# EasyEDA Pro project Tiger Soldering Demo.eprj

# Schematic Schematic 1.1
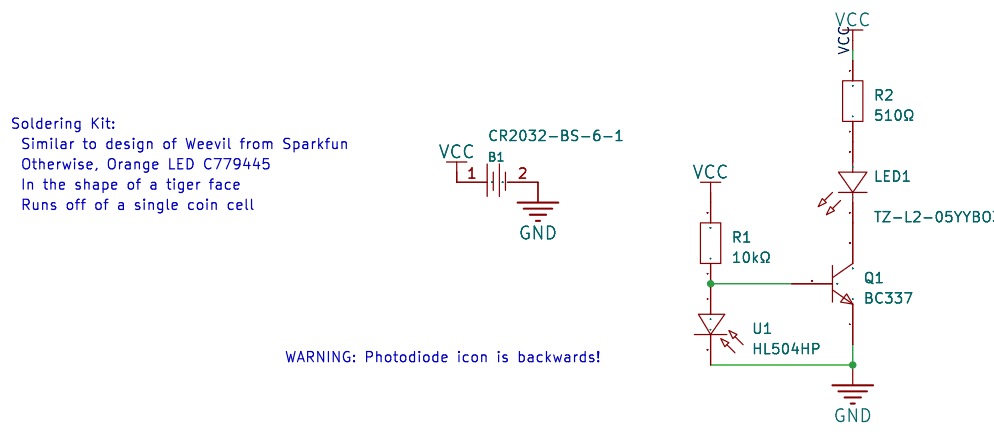
[diagram p0: schematic sheet]

## Parts
B1  CR2032-BS-6-1  [BAT-TH_CR2032-BS-6-1]
LED1  TZ-L2-05YYBO3TDJ15-001  [LED-TH_BD5.8-P2.54-L-RD]
Q1  BC337  [TO-92-3_L4.8-W3.7-P2.54-R]
R1  10kΩ  [RES-TH_BD2.7-L6.2-P10.20-D0.4]
R2  510Ω  [RES-TH_BD2.7-L6.2-P10.20-D0.4]
U1  HL504HP  [LED-TH_BD5.8-P2.54-FD]

## Library data of the parts
B1 = CR2032-BS-6-1: Connector Type:Battery base Battery Type:CR2032 Operating Temperature Range:- Operating Temperature Range:-; LCSC Part Name: 电池底座 适用电池:CR2032; Supplier Part: C70377; Manufacturer: Q&J; Supplier Footprint: SMD; JLCPCB Part Class: Extended Part; Datasheet: https://atta.szlcsc.com/upload/public/pdf/source/20160427/1461725216549.pdf; Supplier: LCSC; Connector Type: Battery base; Battery Type: CR2032
LED1 = TZ-L2-05YYBO3TDJ15-001: Emitted Color:Orange Diode Configuration:- Lens Color:Colorless transparence Dominant Wavelength:600nm~605nm Dominant Wavelength:600nm~605nm Peak Wavelength:- Color Temperature:- Color Temperature:- Forward Current:20mA Power Dissipation:60mW Viewing Angl; LCSC Part Name: 橙灯; Supplier Part: C779445; Manufacturer: TUOZHAN(拓展光电); Supplier Footprint: 插件,D=5mm; JLCPCB Part Class: Extended Part; Datasheet: https://atta.szlcsc.com/upload/public/pdf/source/20200925/C779445_C861B472C10CC762C334E0254EB2FD63.pdf; Supplier: LCSC; Emitted Color: Orange; Lens Color: Colorless transparence; Dominant Wavelength: 600nm~605nm; Forward Current: 20mA; Power Dissipation: 60mW; Viewing Angle: 15°; Operating Temperature: -40℃~+80℃; Lamp Holder Type: 5mm圆形灯头
Q1 = BC337: Transistor Type: Collector-Emitter Breakdown Voltage (Vceo): Collector Current (Ic): Power Dissipation (Pd): Collector Cut-Off Current (Icbo):100nA Collector-Emitter Saturation Voltage (VCE(sat)@Ic,Ib):700mV@500mA,50mA DC Current Gain (hFE@Ic,Vce):100@100; LCSC Part Name: NPN 45V 800mA; Supplier Part: C328602; Manufacturer: BLUE ROCKET(蓝箭); Supplier Footprint: TO-92-3; JLCPCB Part Class: Extended Part; Datasheet: https://atta.szlcsc.com/upload/public/pdf/source/20181114/C328602_2BE2B884E7C282175BCFE1345E8CDD23.pdf; Supplier: LCSC; Collector Cut-Off Current (Icbo): 100nA; Collector-Emitter Saturation Voltage (VCE(sat)@Ic,Ib): 700mV@500mA,50mA; DC Current Gain (hFE@Ic,Vce): 100@100mA,1V; Transition Frequency (fT): 100MHz; Operating Temperature: +150℃@(Tj)
R1 = CR1/4W-10K±5%-ST26: Type:Carbon Resister Resistance: Tolerance:±5% Tolerance:±5% Power(Watts):250mW Temperature Coefficient:±350ppm/℃ Temperature Coefficient:±350ppm/℃ Overload Voltage (Max):250V Operating Temperature Range:-55℃~+155℃ Operating Temperature Range:-55℃~+155℃; LCSC Part Name: 碳膜电阻 10kΩ ±5% 250mW; Supplier Part: C2894599; Manufacturer: VO(翔胜); Supplier Footprint: 插件,2.7x6.2mm; JLCPCB Part Class: Extended Part; Datasheet: https://atta.szlcsc.com/upload/public/pdf/source/20210803/C2857407_45FF53FE186CAB545115AD37303966CD.pdf; Supplier: LCSC; Type: Carbon Resister; Tolerance: ±5%; Power(Watts): 250mW; Temperature Coefficient: ±350ppm/℃; Overload Voltage (Max): 250V; Operating Temperature Range: -55℃~+155℃
R2 = CR1/4W-510Ω±5%-ST26: Type:Carbon Resister Resistance: Tolerance:±5% Tolerance:±5% Power(Watts):250mW Temperature Coefficient:±350ppm/℃ Temperature Coefficient:±350ppm/℃ Overload Voltage (Max):250V Operating Temperature Range:-55℃~+155℃ Operating Temperature Range:-55℃~+155℃; LCSC Part Name: 碳膜电阻 510Ω ±5% 250mW; Supplier Part: C2896843; Manufacturer: VO(翔胜); Supplier Footprint: 轴向引线,2.7x6.2mm; JLCPCB Part Class: Extended Part; Datasheet: https://atta.szlcsc.com/upload/public/pdf/source/20210803/C2857407_45FF53FE186CAB545115AD37303966CD.pdf; Supplier: LCSC; Type: Carbon Resister; Tolerance: ±5%; Power(Watts): 250mW; Temperature Coefficient: ±350ppm/℃; Overload Voltage (Max): 250V; Operating Temperature Range: -55℃~+155℃
U1 = HL504HP: Supplier Part: C242253; Manufacturer: JCHL(晶创和立); Supplier Footprint: 插件,D=5mm; JLCPCB Part Class: Extended Part; Datasheet: https://atta.szlcsc.com/upload/public/pdf/source/20200707/C242253_7EEF6AD93F859C8B56857151B9D59459.pdf; Supplier: LCSC

## Nets
GND: B1.2 Q1.1(E) U1.2(K)
VCC: B1.1 R1.2 R2.2
$1N548: Q1.2(B) R1.1 U1.1(A)
$1N640: LED1.2(+) R2.1
$1N987: LED1.1(-) Q1.3(C)

## Notes on the sheet
- Soldering Kit:
- Otherwise, Orange LED C779445
- Similar to design of Weevil from Sparkfun
- In the shape of a tiger face
- Runs off of a single coin cell
- WARNING: Photodiode icon is backwards!

# Schematic Schematic 1.2
Board Name: V1.2; Create Date: 2025-07-20; Page Name: Tiger Badge; Project Name: Tiger Soldering Demo; Schematic Name: Schematic 1.2; Update Date: 2026-01-14
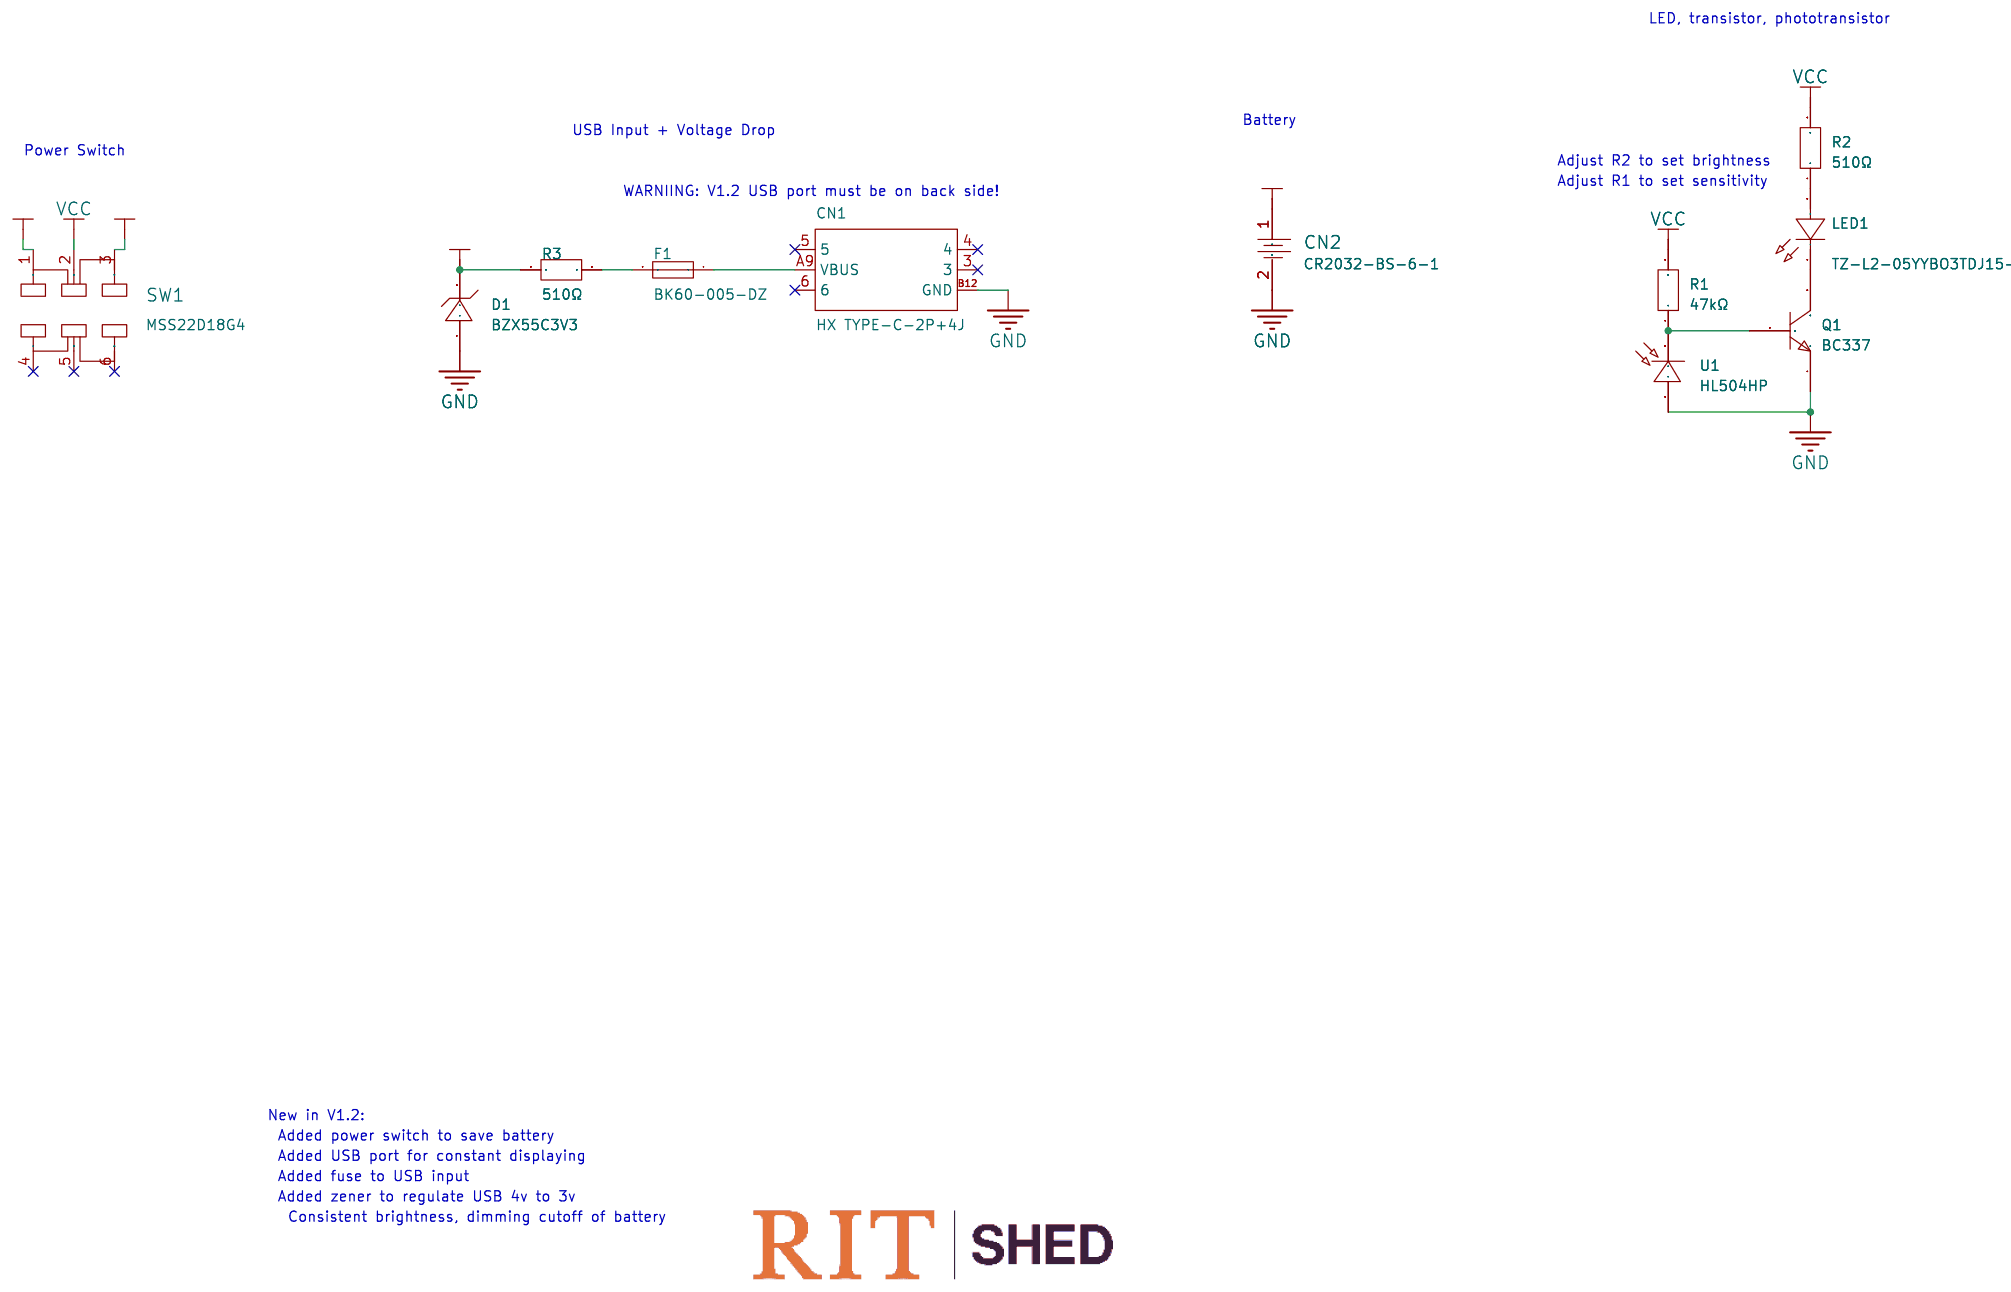
[diagram p1: schematic sheet]

## Parts
CN1  HX TYPE-C-2P+4J  [USB-C-TH_TYPE-C-TYPE-C-2P-4J]
CN2  CR2032-BS-6-1  [BAT-TH_CR2032-BS-6-1]
D1  BZX55C3V3  [DO-35_BD2.0-L4.0-P8.00-D0.5-FD]
F1  BK60-005-DZ  [FUSE-TH_L6.0-W3.0-P5.08-D1.0-S1.0]
LED1  TZ-L2-05YYBO3TDJ15-001  [LED-TH_BD5.8-P2.54-L-RD]
Q1  BC337  [TO-92-3_L4.8-W3.7-P2.54-R]
R1  47kΩ  [RES-TH_BD2.7-L6.2-P10.20-D0.4]
R2  510Ω  [RES-TH_BD2.7-L6.2-P10.20-D0.4]
R3  510Ω  [RES-TH_BD2.7-L6.2-P10.20-D0.4]
SW1  MSS22D18G4  [SW-TH_MSS22D18GX]
U1  HL504HP  [LED-TH_BD5.8-P2.54-FD]

## Library data of the parts
CN1 = HX TYPE-C-2P+4J: Connector Type:Type-C Protocol Standard:- Gender:Female Mounting Type:Bend-in Number of Contacts:2P Number of Ports:1 Current Rating-Power:3A Voltage Rating:20V Connect-Disconnect Life:5000 Cuts Center Height:1.68mm Length:6.5mm Detection color:Black Oper; LCSC Part Name: Type-C 母 弯插; Supplier Part: C25168796; Manufacturer: hanxia(韩下); Supplier Footprint: 插件; JLCPCB Part Class: Extended Part; Datasheet: https://atta.szlcsc.com/upload/public/pdf/source/20250106/37D5C40B555D99FBC6ED90BAD13C794C.pdf; Supplier: LCSC; Connector Type: Type-C; Gender: Female; Mounting Type: Bend-in; Number of Contacts: 2P; Number of Ports: 1; Current Rating-Power: 3A; Voltage Rating: 20V; Connect-Disconnect Life: 5000 Cuts; Center Height: 1.68mm; Length: 6.5mm; Detection color: Black; Operating Temperature: -30℃~+80℃
CN2 = CR2032-BS-6-1: Connector Type:Battery base Battery Type:CR2032 Operating Temperature Range:- Operating Temperature Range:-; LCSC Part Name: 电池底座 适用电池:CR2032; Supplier Part: C70377; Manufacturer: Q&J; Supplier Footprint: SMD; JLCPCB Part Class: Extended Part; Datasheet: https://atta.szlcsc.com/upload/public/pdf/source/20160427/1461725216549.pdf; Supplier: LCSC; Connector Type: Battery base; Battery Type: CR2032
D1 = BZX55C3V3: Supplier Part: C2507; Manufacturer: ST(先科); Supplier Footprint: DO-35; JLCPCB Part Class: Extended Part; Datasheet: https://atta.szlcsc.com/upload/public/pdf/source/20170719/C118630_1500457760295828336.pdf; Supplier: LCSC; Diode Configuration: Independent Type; Zener Voltage(Nom): 3.3V; Reverse Leakage Current (Ir): 2uA@1V; Zener Voltage(Range): 3.1V~3.5V; Impedance(Zzt): 85Ω
F1 = BK60-005-DZ: LCSC Part Name: 60V 50mA 插件自恢复; Supplier Part: C268796; Manufacturer: Brightking(君耀电子); Supplier Footprint: 插件; Datasheet: https://atta.szlcsc.com/upload/public/pdf/source/20181228/C268805_884F985A40511EB6935C25FE5D5FD463.pdf; Supplier: LCSC; Voltage - Max: 60V; Current - Max: 40A; Hold Current: 50mA; Trip Current: 100mA; Power Dissipation: 300mW; Resistance - Initial (Ri) (Min): 7.5Ω; Resistance - Post Trip (R1) (Max): 25Ω; Time to Trip(Max): 5s; Operating Temperature: -40℃~+85℃
LED1 = TZ-L2-05YYBO3TDJ15-001: Emitted Color:Orange Diode Configuration:- Lens Color:Colorless transparence Dominant Wavelength:600nm~605nm Dominant Wavelength:600nm~605nm Peak Wavelength:- Color Temperature:- Color Temperature:- Forward Current:20mA Power Dissipation:60mW Viewing Angl; LCSC Part Name: 橙灯; Supplier Part: C779445; Manufacturer: TUOZHAN(拓展光电); Supplier Footprint: 插件,D=5mm; JLCPCB Part Class: Extended Part; Datasheet: https://atta.szlcsc.com/upload/public/pdf/source/20200925/C779445_C861B472C10CC762C334E0254EB2FD63.pdf; Supplier: LCSC; Emitted Color: Orange; Lens Color: Colorless transparence; Dominant Wavelength: 600nm~605nm; Forward Current: 20mA; Power Dissipation: 60mW; Viewing Angle: 15°; Operating Temperature: -40℃~+80℃; Lamp Holder Type: 5mm圆形灯头
Q1 = BC337: Transistor Type: Collector-Emitter Breakdown Voltage (Vceo): Collector Current (Ic): Power Dissipation (Pd): Collector Cut-Off Current (Icbo):100nA Collector-Emitter Saturation Voltage (VCE(sat)@Ic,Ib):700mV@500mA,50mA DC Current Gain (hFE@Ic,Vce):100@100; LCSC Part Name: NPN 45V 800mA; Supplier Part: C328602; Manufacturer: BLUE ROCKET(蓝箭); Supplier Footprint: TO-92-3; JLCPCB Part Class: Extended Part; Datasheet: https://atta.szlcsc.com/upload/public/pdf/source/20181114/C328602_2BE2B884E7C282175BCFE1345E8CDD23.pdf; Supplier: LCSC; Collector Cut-Off Current (Icbo): 100nA; Collector-Emitter Saturation Voltage (VCE(sat)@Ic,Ib): 700mV@500mA,50mA; DC Current Gain (hFE@Ic,Vce): 100@100mA,1V; Transition Frequency (fT): 100MHz; Operating Temperature: +150℃@(Tj)
R1 = CR1/4W-47K±5%-ST52: LCSC Part Name: 碳膜电阻 47kΩ ±5% 250mW; Supplier Part: C2896823; Manufacturer: VO(翔胜); Supplier Footprint: 插件,D2.7xL6.2mm; JLCPCB Part Class: Extended Part; Datasheet: https://atta.szlcsc.com/upload/public/pdf/source/20210803/C2857407_45FF53FE186CAB545115AD37303966CD.pdf; Supplier: LCSC; Type: Carbon Resister; Tolerance: ±5%; Overload Voltage (Max): 250V; Power(Watts): 250mW; Temperature Coefficient: ±350ppm/℃; Operating Temperature Range: -55℃~+155℃
R2 R3 = CR1/4W-510Ω±5%-ST26: Type:Carbon Resister Resistance: Tolerance:±5% Tolerance:±5% Power(Watts):250mW Temperature Coefficient:±350ppm/℃ Temperature Coefficient:±350ppm/℃ Overload Voltage (Max):250V Operating Temperature Range:-55℃~+155℃ Operating Temperature Range:-55℃~+155℃; LCSC Part Name: 碳膜电阻 510Ω ±5% 250mW; Supplier Part: C2896843; Manufacturer: VO(翔胜); Supplier Footprint: 轴向引线,2.7x6.2mm; JLCPCB Part Class: Extended Part; Datasheet: https://atta.szlcsc.com/upload/public/pdf/source/20210803/C2857407_45FF53FE186CAB545115AD37303966CD.pdf; Supplier: LCSC; Type: Carbon Resister; Tolerance: ±5%; Power(Watts): 250mW; Temperature Coefficient: ±350ppm/℃; Overload Voltage (Max): 250V; Operating Temperature Range: -55℃~+155℃
SW1 = MSS22D18G4: LCSC Part Name: 两档立式插件 6脚拨动 柄长4.0MM; Supplier Part: C431543; Manufacturer: SHOU HAN(首韩); Supplier Footprint: 插件-6P,3.5x9.1mm; Datasheet: https://atta.szlcsc.com/upload/public/pdf/source/20190925/C431543_23D6A1346867CD8092E28E3FB07BC582.pdf; Supplier: LCSC; Circuit: DPDT; Pin Style: SMDSplicing; Switch Length: 9.1mm; Switch Width: 3.5mm; Switch Height: 3.5mm; Mounting Style: Straight; Current Rating (DC): 100mA; Voltage Rating (DC): 12V; Mechanical Life: 1万次; Operating Temperature: -10℃~+50℃
U1 = HL504HP: Supplier Part: C242253; Manufacturer: JCHL(晶创和立); Supplier Footprint: 插件,D=5mm; JLCPCB Part Class: Extended Part; Datasheet: https://atta.szlcsc.com/upload/public/pdf/source/20200707/C242253_7EEF6AD93F859C8B56857151B9D59459.pdf; Supplier: LCSC

## Nets
GND: CN1.B12(GND) CN2.2 D1.1(A) Q1.1(E) U1.1(A)
VBAT: CN2.1 SW1.3
VCC: R1.2 R2.2 SW1.2
VUSB: D1.2(K) R3.1 SW1.1
$1N548: Q1.2(B) R1.1 U1.2(K)
$1N640: LED1.2(+) R2.1
$1N987: LED1.1(-) Q1.3(C)
$1N3231: CN1.A9(VBUS) F1.1
$1N3603: F1.2 R3.2

Not connected (* = marked no-connect by the designer): CN1 3* 4* 5* 6*; SW1 4* 5* 6*

## Notes on the sheet
- LED, transistor, phototransistor
- USB Input + Voltage Drop
- Battery
- Power Switch
- Adjust R2 to set brightness
- Adjust R1 to set sensitivity
- WARNIING: V1.2 USB port must be on back side!
- New in V1.2:
- Added power switch to save battery
- Added USB port for constant displaying
- Added fuse to USB input
- Added zener to regulate USB 4v to 3v
- Consistent brightness, dimming cutoff of battery

# Board PCB 1.1
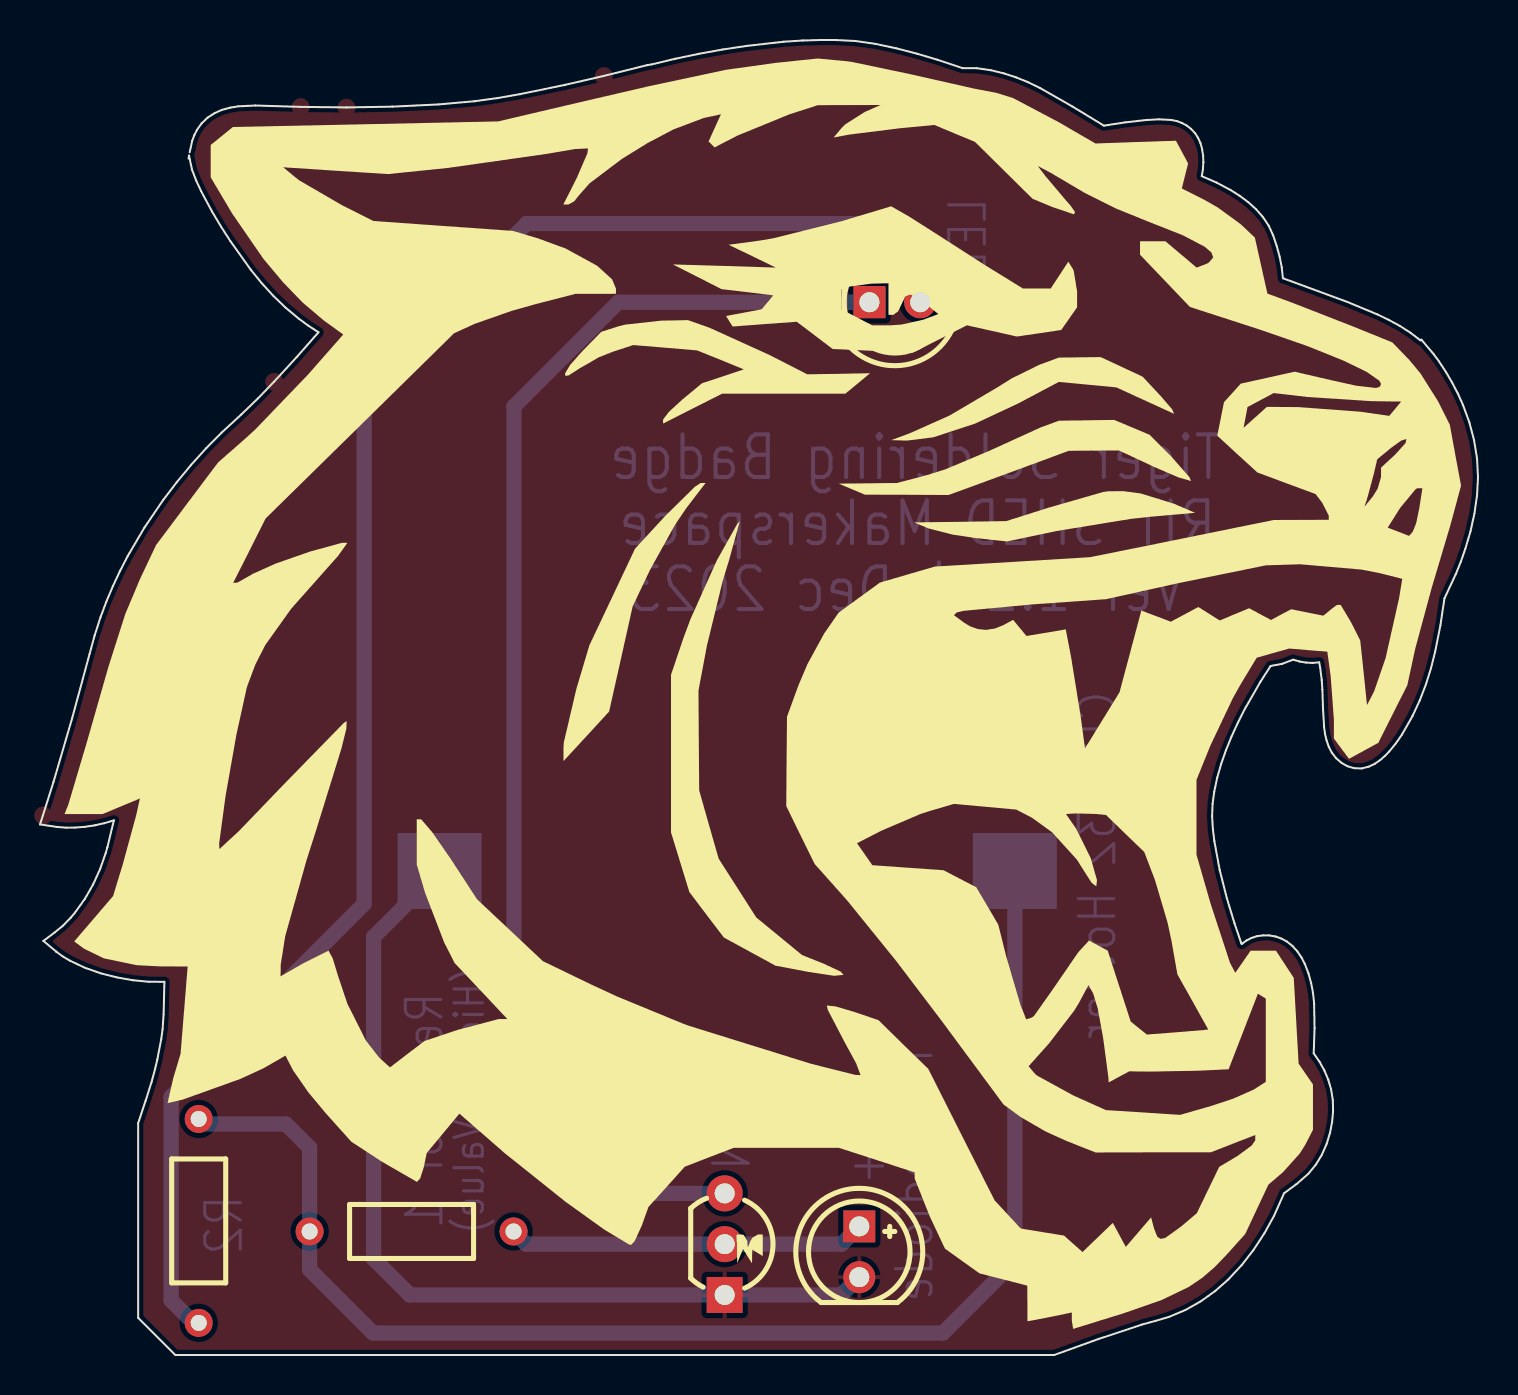
[diagram p2: board, top side]
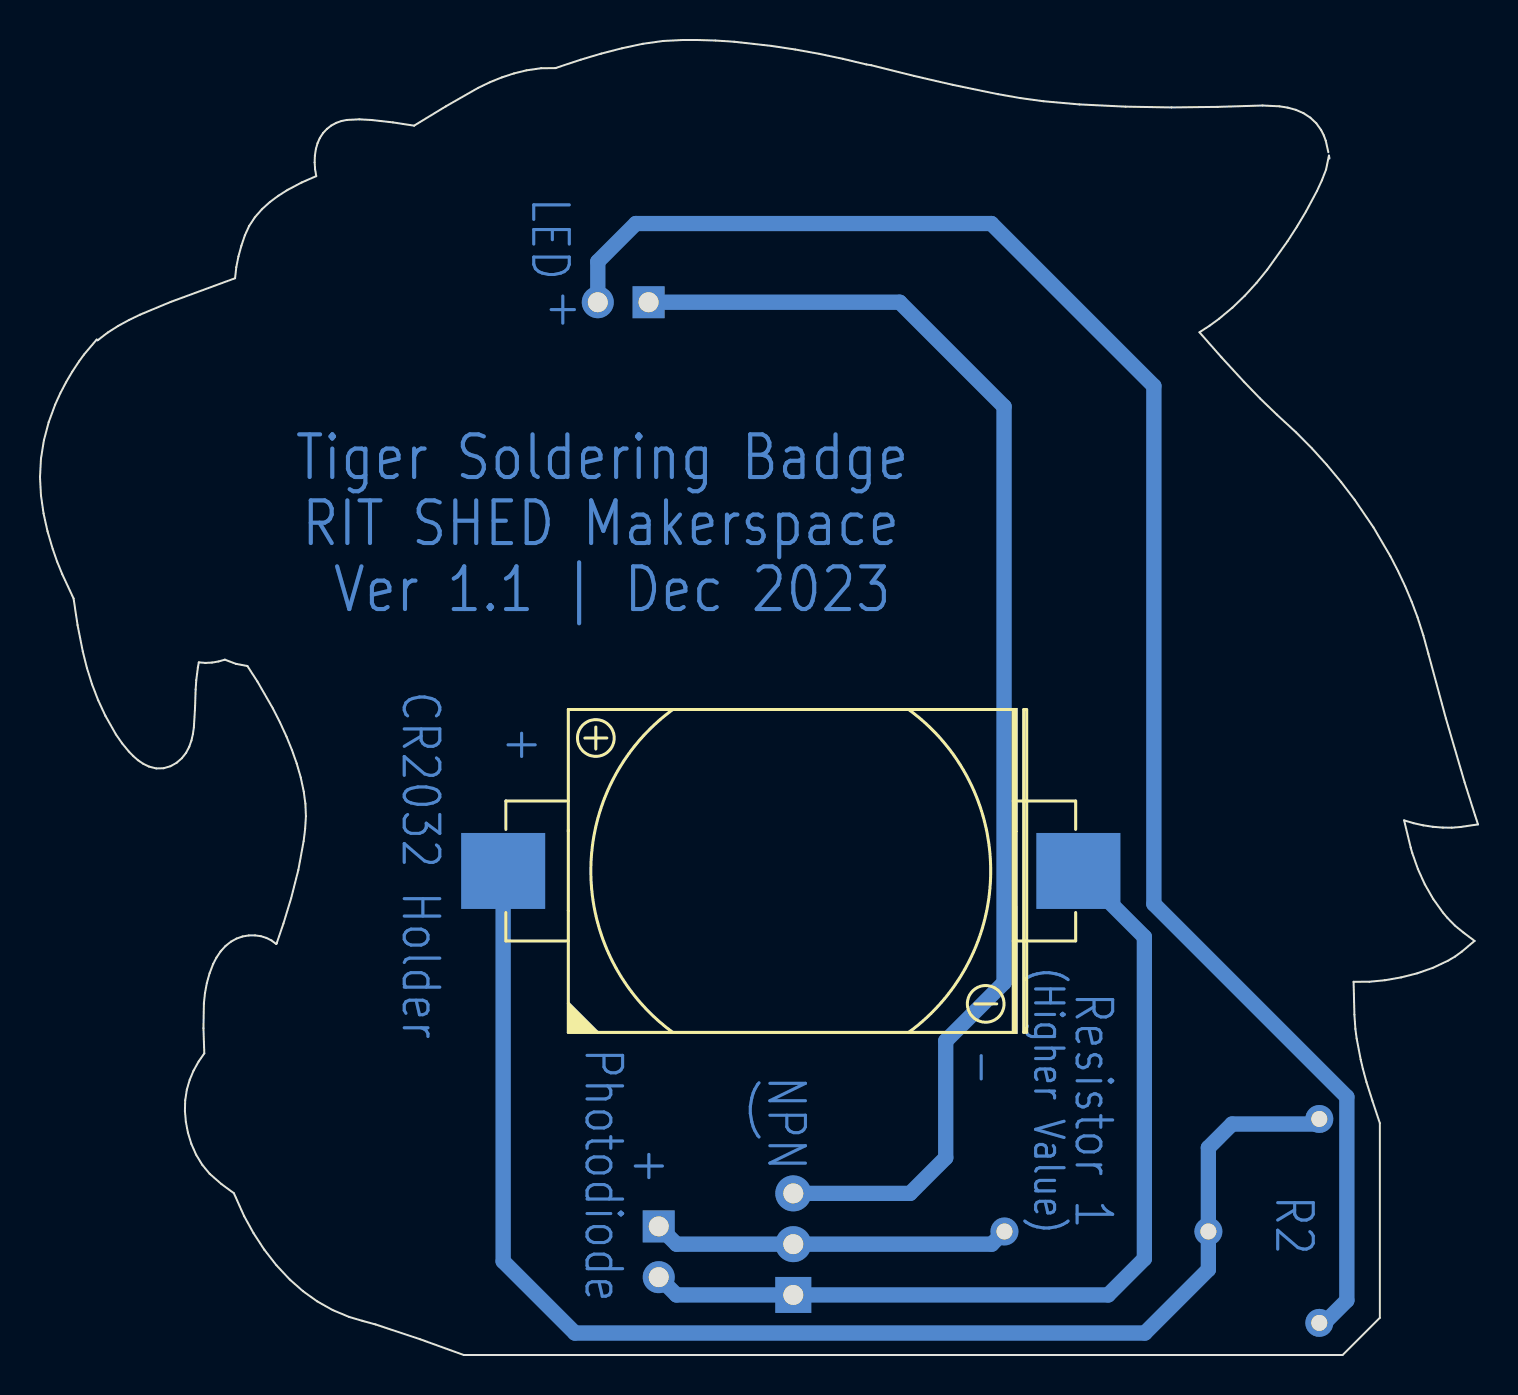
[diagram p3: board, bottom side, seen from below]

Outline 71.93 x 65.78 mm; copper layers: Top Layer, Bottom Layer. Coordinates in mm from the lower left corner of the outline.
Stack: Top Layer 0.035mm / Dielectric1 1.51mm FR4 er 4.5 / Bottom Layer 0.035mm

## Design rules (mm)
template: JLCPCB Capability(Two Layers Board)
spacing copperThickness1oz (default): track to track 0.102, other pairs 0.152 to 0.3
spacing copperThickness2oz: track to track 0.203, other pairs 0.152 to 0.3
track width copperThickness1oz (default): min 0.127, default 0.254, max 2.54
track width copperThickness2oz: min 0.203, default 0.254, max 2.54
differential pair differentialPair (default): width min 0.127, default 0.254, max 2.54; gap min 0.152, default 0.152
via viaSize (default): diameter min 0.5, default 0.61, max 10; hole min 0.3, default 0.305, max 6.3

## Placement (name value [footprint] x y rotation side)
B1  CR2032-BS-6-1  [BAT-TH_CR2032-BS-6-1]  34.37 24.21 0 bottom
LED1  TZ-L2-05YYBO3TDJ15-001  [LED-TH_BD5.8-P2.54-L-RD]  42.76 52.66 0 top
Q1  BC337  [TO-92-3_L4.8-W3.7-P2.54-R]  34.25 5.54 270 top
R1  10kΩ  [RES-TH_BD2.7-L6.2-P10.20-D0.4]  18.59 6.18 180 top
R2  510Ω  [RES-TH_BD2.7-L6.2-P10.20-D0.4]  7.94 6.71 90 top
U1  HL504HP  [LED-TH_BD5.8-P2.54-FD]  40.98 5.16 270 top

## Footprints (pads in the part's own frame, mm; a bottom-side part is the same pattern mirrored in y, then rotated)
BAT-TH_CR2032-BS-6-1
  rect 4.2x3.8 smd: 1(14.385,0) 2(-14.385,0)
LED-TH_BD5.8-P2.54-FD
  rect 1.6x1.6 hole 1: 1(-1.27,0)
  round 1.6 hole 1: 2(1.27,0)
LED-TH_BD5.8-P2.54-L-RD
  rect 1.6x1.6 hole 1: 1(-1.27,0)
  round 1.6 hole 1: 2(1.27,0)
RES-TH_BD2.7-L6.2-P10.20-D0.4
  round 1.4 hole 0.8: 1(-5.1,0) 2(5.1,0)
TO-92-3_L4.8-W3.7-P2.54-R
  rect 1.8x1.8 hole 1: 1(2.54,0)
  round 1.8 hole 1: 2(0,0) 3(-2.54,0)

## Nets
As in the schematic.

## Routing (per net, layer and track width the routed paths; a pad name or vN(x,y) marks a point on that pad's centre or on a via; arc(x,y) is an arc through that point)
GND: length 46.2
  Bottom Layer w0.762: B1.2 16.69,20.91 16.69,4.82 18.5,3 Q1.1 40.09,3 U1.2
VCC: length 70.9
  Bottom Layer w0.762: 7.94,11.55 12.3,11.55 13.49,10.37 13.49,4.27 16.66,1.1 45.17,1.1 48.76,4.69 48.76,25.36
$1N548: length 17.9
  Bottom Layer w0.762: R1.1 24.32,5.54 Q1.2 40.09,5.54 U1.1
$1N640: length 85.7
  Bottom Layer w0.762: LED1.2 44.03,54.69 42.12,56.6 24.34,56.6 16.21,48.47 16.21,22.56 6.56,12.91 6.56,2.73 7.94,1.35
$1N987: length 67.1
  Bottom Layer w0.762: LED1.1 28.93,52.66 23.71,47.44 23.71,18.63 26.62,15.71 26.62,9.87 28.41,8.08 Q1.3

## Copper pours and planes (outline as drawn; the poured copper is in the pictures)
GND on Top Layer: -1.06,69.04 74.12,69.04 74.12,-5.38 -1.06,-5.38

## Text on the board
Bottom Layer: (Higher Value) | R2 | Resistor 1 | NPN | + | Photodiode | ) | - | LED | CR2032 Holder | Ver 1.1 | Dec 2023 | RIT SHED Makerspace | Tiger Soldering Badge
Bottom Solder Mask Layer: (Higher Value) | R2 | Resistor 1 | NPN | + | Photodiode | ) | - | LED | CR2032 Holder | Ver 1.1 | Dec 2023 | RIT SHED Makerspace | Tiger Soldering Badge
Top Solder Mask Layer: SHED RIT

# Board PCB 1.2
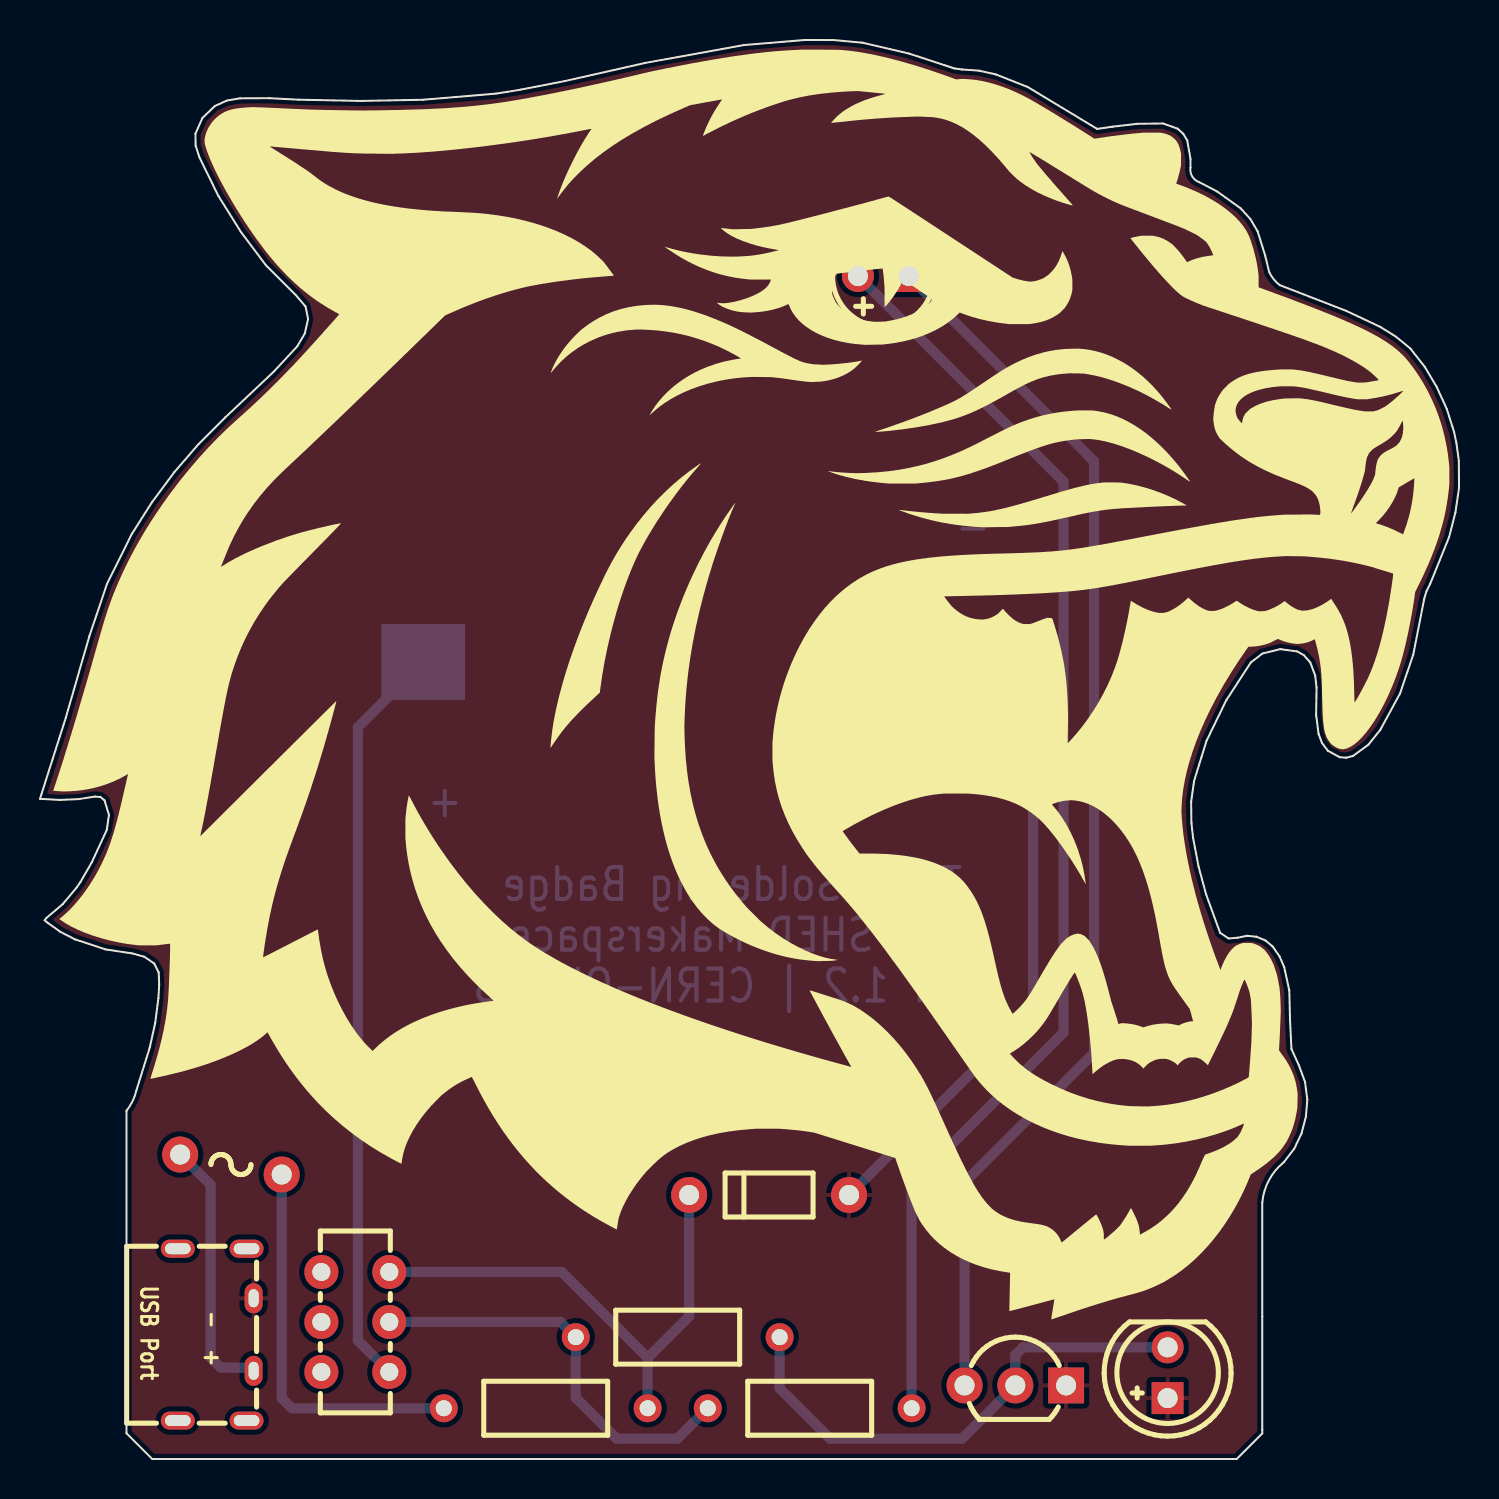
[diagram p4: board, top side]
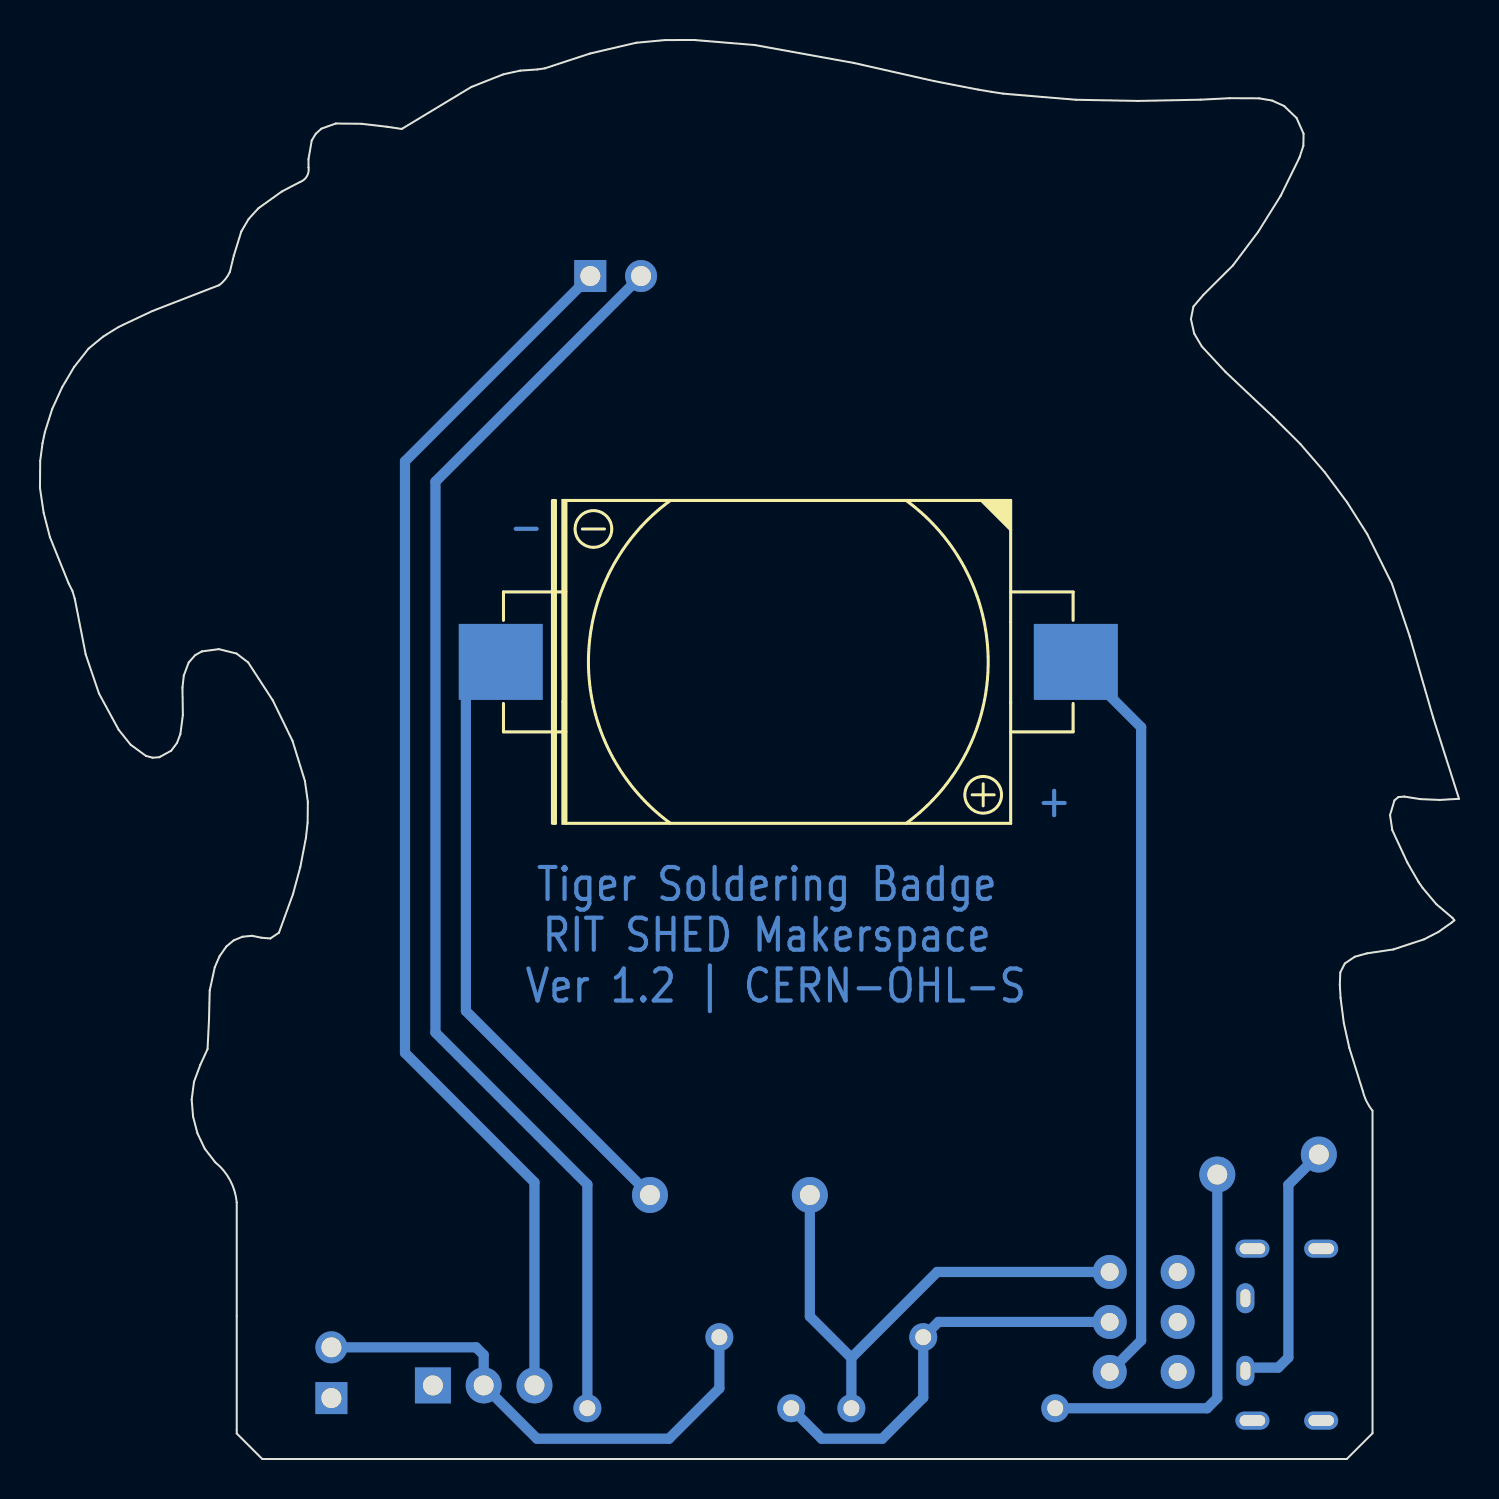
[diagram p5: board, bottom side, seen from below]

Outline 71 x 70.99 mm; copper layers: Top Layer, Bottom Layer. Coordinates in mm from the lower left corner of the outline.
Outline path: 0,33.03 0.97,32.97 1.93,33.01 2.74,33.14 3.03,33.12 3.23,32.95 3.45,32.22 3.34,31.46 2.59,29.84 2.02,28.86 1.82,28.58 1.14,27.76 0.32,27.07 0.23,26.95 0.37,26.83 1.03,26.37 1.75,26 3.28,25.49 4.61,25.3 5.21,25.13 5.71,24.79 5.94,24.34 5.96,23.73 5.93,23.07 5.76,21.81 5.49,20.57 4.81,18.4 arc(4.62,17.89) 4.33,17.42 4.33,1.29 5.62,0 59.87,0 61.15,1.28 61.15,12.84 arc(61.48,13.95) 62.22,14.84 62.75,15.52 63.12,16.29 63.33,17.13 63.41,17.98 63.29,18.87 62.98,19.71 62.61,20.51 62.54,21.98 62.5,23.44 62.25,24.61 62.01,25.15 61.67,25.64 61.3,25.95 60.86,26.13 60.39,26.18 59.92,26.08 59.47,26.04 59.04,26.33 58.34,28.25 57.97,29.62 57.69,31.08 57.61,31.83 57.59,32.88 57.74,33.92 58.36,35.93 59.35,37.96 60.58,39.85 61.16,40.29 62.05,40.52 62.9,40.4 63.23,40.22 63.56,39.85 63.8,39.2 63.87,38.59 63.85,37.22 63.97,36.26 64.14,35.82 64.43,35.44 65.02,35.11 65.36,35.08 65.69,35.18 66.46,35.73 67.06,36.48 68.04,38.29 68.71,40.25 69.25,43.04 69.37,43.43 69.56,43.8 70.5,46.12 70.81,47.34 71,48.58 70.99,49.94 70.87,50.81 70.75,51.38 70.38,52.53 69.89,53.62 69.29,54.63 68.56,55.55 67.84,56.15 67.05,56.64 65.37,57.43 62.03,58.73 arc(61.72,59.02) 61.5,59.39 61.3,60.2 60.92,61.41 60.55,62.04 60.07,62.57 58.89,63.41 57.99,63.88 arc(57.64,64.17) 57.56,64.61 57.56,65.04 57.4,65.96 57.2,66.3 56.91,66.55 56.19,66.81 54.91,66.8 53.64,66.65 52.89,66.54 49.42,68.64 47.81,69.27 46.97,69.46 46.11,69.52 45.74,69.57 43.47,70.31 41.16,70.85 39.72,70.99 38.27,70.99 35.23,70.74 30.27,69.84 26.25,68.93 24.06,68.51 23.4,68.4 22.81,68.31 19.16,68 16.05,67.94 12.94,68 11.47,68.08 10.01,68.07 9.35,67.96 8.75,67.69 8.13,67.09 7.78,66.3 7.79,65.69 7.98,65.11 8.92,63.2 10.05,61.39 11.31,59.71 12.79,58.23 13.29,57.66 13.41,57.03 13.25,56.3 12.87,55.66 11.69,54.4 9.27,52.11 7.94,50.78 6.72,49.36 5.6,47.86 4.59,46.27 3.36,43.79 2.47,41.16 1.29,37.08 0,33.03
Stack: Top Layer 0.035mm / Dielectric1 1.51mm FR4 er 4.5 / Bottom Layer 0.035mm

## Design rules (mm)
template: Custom Config
spacing copperThickness1oz (default): track to track 0.102, other pairs 0 to 0.3
spacing copperThickness2oz: track to track 0.203, other pairs 0.152 to 0.3
track width copperThickness1oz (default): min 0.127, default 0.254, max 2.54
track width copperThickness2oz: min 0.203, default 0.254, max 2.54
differential pair differentialPair (default): width min 0.127, default 0.254, max 2.54; gap min 0.152, default 0.152
via viaSize (default): diameter min 0.5, default 0.61, max 10; hole min 0.3, default 0.305, max 6.3

## Placement (name value [footprint] x y rotation side)
CN1  HX TYPE-C-2P+4J  [USB-C-TH_TYPE-C-TYPE-C-2P-4J]  8.79 6.22 270 top
CN2  CR2032-BS-6-1  [BAT-TH_CR2032-BS-6-1]  33.56 39.88 180 bottom
D1  BZX55C3V3  [DO-35_BD2.0-L4.0-P8.00-D0.5-FD]  36.48 13.21 180 top
F1  BK60-005-DZ  [FUSE-TH_L6.0-W3.0-P5.08-D1.0-S1.0]  9.55 14.73 0 top
LED1  TZ-L2-05YYBO3TDJ15-001  [LED-TH_BD5.8-P2.54-L-RD]  42.19 59.18 180 top
Q1  BC337  [TO-92-3_L4.8-W3.7-P2.54-R]  48.8 3.68 0 top
R1  47kΩ  [RES-TH_BD2.7-L6.2-P10.20-D0.4]  31.91 6.1 180 top
R2  510Ω  [RES-TH_BD2.7-L6.2-P10.20-D0.4]  38.51 2.54 180 top
R3  510Ω  [RES-TH_BD2.7-L6.2-P10.20-D0.4]  25.3 2.54 180 top
SW1  MSS22D18G4  [SW-TH_MSS22D18GX]  15.78 6.86 270 top
U1  HL504HP  [LED-TH_BD5.8-P2.54-FD]  56.42 4.32 90 top

## Footprints (pads in the part's own frame, mm; a bottom-side part is the same pattern mirrored in y, then rotated)
BAT-TH_CR2032-BS-6-1
  rect 4.2x3.8 smd: 1(14.385,0) 2(-14.385,0)
DO-35_BD2.0-L4.0-P8.00-D0.5-FD
  round 1.8 hole 1: 1(-4,0) 2(4,0)
FUSE-TH_L6.0-W3.0-P5.08-D1.0-S1.0
  round 1.8 hole 1: 1(-2.54,0.5) 2(2.54,-0.5)
LED-TH_BD5.8-P2.54-FD
  rect 1.6x1.6 hole 1: 1(-1.27,0)
  round 1.6 hole 1: 2(1.27,0)
LED-TH_BD5.8-P2.54-L-RD
  rect 1.6x1.6 hole 1: 1(-1.27,0)
  round 1.6 hole 1: 2(1.27,0)
RES-TH_BD2.7-L6.2-P10.20-D0.4
  round 1.4 hole 0.8: 1(-5.1,0) 2(5.1,0)
SW-TH_MSS22D18GX
  round 1.7 hole 0.9: 1(-2.5,1.7) 2(0,1.7) 3(2.5,1.7) 4(-2.5,-1.7) 5(0,-1.7) 6(2.5,-1.7)
TO-92-3_L4.8-W3.7-P2.54-R
  rect 1.8x1.8 hole 1: 1(2.54,0)
  round 1.8 hole 1: 2(0,0) 3(-2.54,0)
USB-C-TH_TYPE-C-TYPE-C-2P-4J
  oval 0.9x1.7 hole 0.55x1.28: 3(4.3,1.544) 4(4.3,-1.897) 5(-4.3,-1.897) 6(-4.3,1.544)
  oval 1.5x0.9 hole 0.9x0.5: A9(1.81,1.897) B12(-1.82,1.897)

## Nets
As in the schematic.

Pads without a net: CN1 3 4 5 6; SW1 4 5 6

## Routing (per net, layer and track width the routed paths; a pad name or vN(x,y) marks a point on that pad's centre or on a via; arc(x,y) is an arc through that point)
GND: length 31.2
  Bottom Layer w0.508: D1.1 49.69,22.42 49.69,38.13 CN2.2
VBAT: length 37.5
  Bottom Layer w0.508: CN2.1 15.9,36.61 15.9,5.93 SW1.3
VCC: length 20.8
  Bottom Layer w0.508: R2.2 31.89,1.02 28.86,1.02 26.81,3.07 R1.2 26.04,6.86 SW1.2
VUSB: length 26.2
  Bottom Layer w0.508: SW1.1 26.1,9.36 30.4,5.06 ; D1.2 32.48,7.14 30.4,5.06 ; 30.4,5.06 R3.1
$1N548: length 25.8
  Bottom Layer w0.508: R1.1 37.01,3.54 39.53,1.02 46.13,1.02 Q1.2 48.8,5.21 49.18,5.59 U1.2
$1N640: length 64.1
  Bottom Layer w0.508: LED1.2 51.21,48.9 51.21,21.34 43.61,13.74 R2.1
$1N987: length 62
  Bottom Layer w0.508: Q1.3 46.26,13.84 52.73,20.32 52.73,49.91 LED1.1
$1N3231: length 13.2
  Bottom Layer w0.508: 7.01,15.24 8.54,13.72 8.54,5.08 9.05,4.57 10.53,4.57 CN1.A9
$1N3603: length 19.5
  Bottom Layer w0.508: F1.2 12.09,3.05 12.6,2.54 R3.2

## Copper pours and planes (outline as drawn; the poured copper is in the pictures)
GND on Top Layer: -1.11,73.15 76.1,73.15 76.1,-6.1 -1.11,-6.1

## Text on the board
Bottom Layer: + | RIT SHED Makerspace | Tiger Soldering Badge | Ver 1.2 | CERN-OHL-S | -
Bottom Solder Mask Layer: + | RIT SHED Makerspace | Tiger Soldering Badge | Ver 1.2 | CERN-OHL-S | -
Top Solder Mask Layer: make.rit.edu
Top Silkscreen Layer: USB Port | -  +
